# Altium schematic sheet powerPCB.SchDoc
size A; SheetNumber: 1; SheetTotal: 1
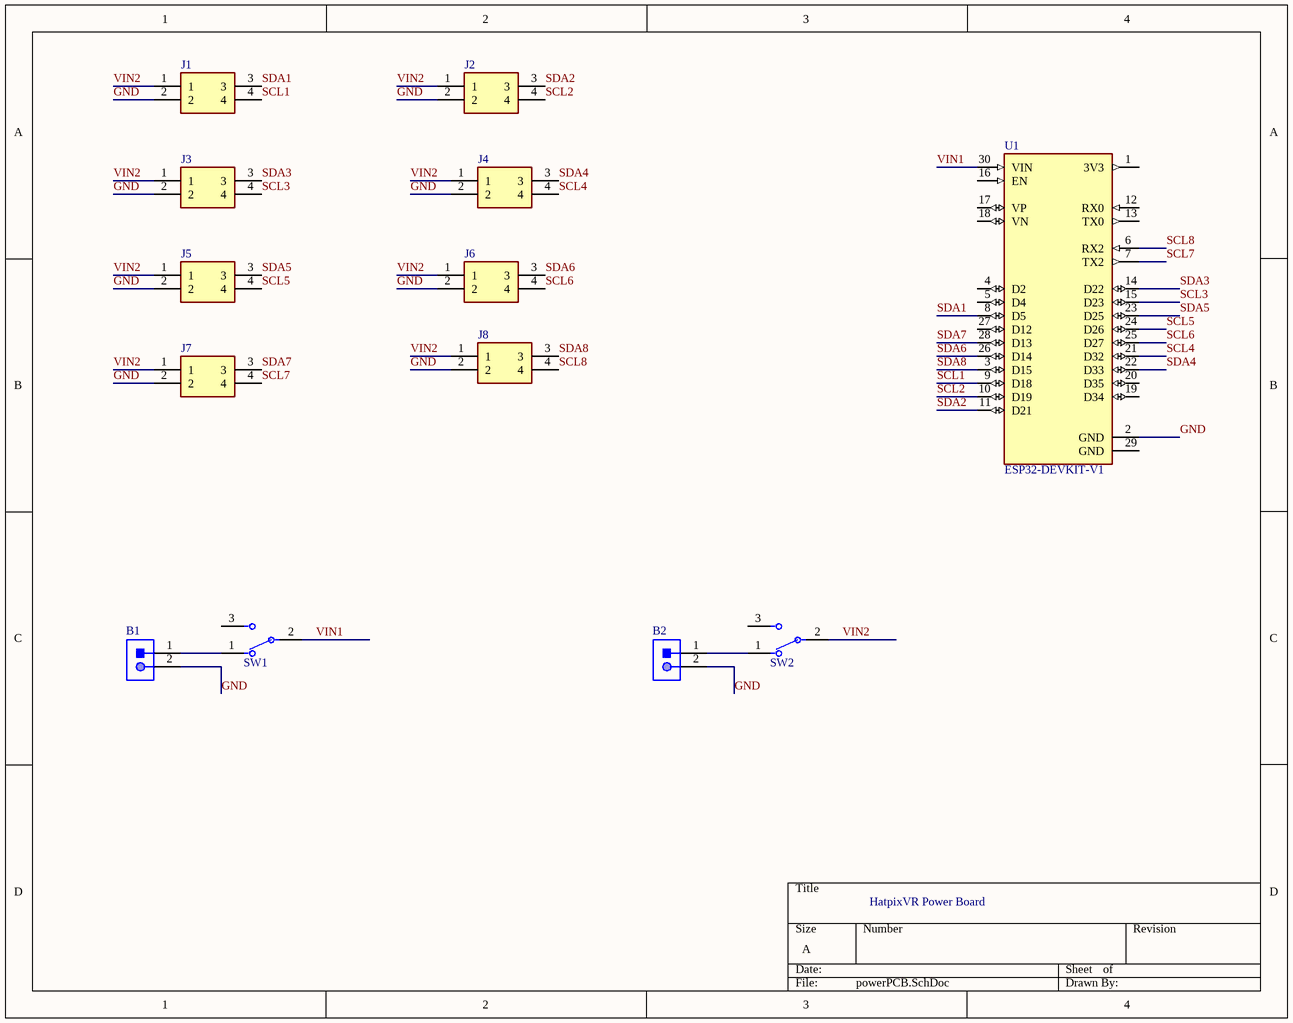
[diagram p0: powerPCB.SchDoc]

## Parts
B1  S2B-PH-K-S(LF)(SN)  [JST-S2B-PH-K-S_V]  (value not drawn)
B2  S2B-PH-K-S(LF)(SN)  [JST-S2B-PH-K-S_V]  (value not drawn)
J1  200528-0040  [200528-0040]  (value not drawn)
J2  200528-0040  [200528-0040]  (value not drawn)
J3  200528-0040  [200528-0040]  (value not drawn)
J4  200528-0040  [200528-0040]  (value not drawn)
J5  200528-0040  [200528-0040]  (value not drawn)
J6  200528-0040  [200528-0040]  (value not drawn)
J7  200528-0040  [200528-0040]  (value not drawn)
J8  200528-0040  [200528-0040]  (value not drawn)
SW1  1101M2S3CGE2  [FP-1101M2S3CGE2-MFG]  (value not drawn)
SW2  1101M2S3CGE2  [FP-1101M2S3CGE2-MFG]  (value not drawn)
U1  ESP32-DEVKIT-V1  [MODULE_ESP32_DEVKIT_V1]

## Nets
GND: B1.2 B2.2 J1.2 J2.2 J3.2 J4.2 J5.2 J6.2 J7.2 J8.2 U1.2(GND)
SCL1: J1.4 U1.9(D18)
SCL2: J2.4 U1.10(D19)
SCL3: J3.4 U1.15(D23)
SCL4: J4.4 U1.21(D32)
SCL5: J5.4 U1.24(D26)
SCL6: J6.4 U1.25(D27)
SCL7: J7.4 U1.7(TX2)
SCL8: J8.4 U1.6(RX2)
SDA1: J1.3 U1.8(D5)
SDA2: J2.3 U1.11(D21)
SDA3: J3.3 U1.14(D22)
SDA4: J4.3 U1.22(D33)
SDA5: J5.3 U1.23(D25)
SDA6: J6.3 U1.26(D14)
SDA7: J7.3 U1.28(D13)
SDA8: J8.3 U1.3(D15)
VIN1: SW1.2(COMM) U1.30(VIN)
VIN2: J1.1 J2.1 J3.1 J4.1 J5.1 J6.1 J7.1 J8.1 SW2.2(COMM)
NetB1_1: B1.1 SW1.1
NetB2_1: B2.1 SW2.1

Not connected (* = marked no-connect by the designer): SW1 3; SW2 3; U1 1(3V3) 4(D2) 5(D4) 12(RX0) 13(TX0) 16(EN) 17(VP) 18(VN) 19(D34) 20(D35) 27(D12) 29(GND)

## Notes on the sheet
- HatpixVR Power Board

## Library data of the parts
B1 B2 = CMP-1755-00004-1: Male Header, Pitch 2 mm, 1 x 2 Position, Height 4.8 mm, Tail Length 3.4 mm, -25 to 85 degC, RoHS, Bulk; Case\Package: Radial; Tolerance: 20%; Capacitance: 10 uF; Voltage Rating (DC): 50 V; Packaging: Bulk; ComponentLink1URL: http://www.jst-mfg.com/product/pdf/eng/ePH.pdf; Radiation Hardening: No; Height: 11 mm; Package Quantity: 200; PackageDescription: Male Header, Pitch 2 mm, 1 x 2 Position, Height 4.8 mm, Tail Length 3.4 mm; PackageReference: S2B-PH-K-S; Diameter: 5 mm; Pins: 2; Mount: Through Hole; Max Operating Temperature: 85 degC; Min Operating Temperature: -40 degC; ComponentLink1Description: Datasheet; DatasheetVersion: Dec-12; Length: 11 mm; Lead Pitch: 2 mm; REACH SVHC: No SVHC; Voltage Rating: 50 V; RoHSCompliant: true
J1-J8 = 200528-0040: Connector; Manufacturer_Name: Molex; Description: 1.0mm R/A FFC/FPC connector; Datasheet Link: http://www.molex.com/webdocs/datasheets/pdf/en-us//2005280040_FFC_FPC_CONNECTORS.pdf; Manufacturer_Part_Number: 200528-0040; Mouser Part Number: 538-200528-0040; Mouser Price/Stock: https://www.mouser.co.uk/ProductDetail/Molex/200528-0040?qs=IvjI65BR3TWJ39ZrkPFPSw%3D%3D
SW1 SW2 = CMP-10038-000004-1: SWITCH SLIDE SPDT 6A 120V; Manufacturer: C&K Components; Contact Resistance: 10mΩ; Voltage Rating Dc: 28V; Electromechanical Life: 40000Cycles; Octopart: https://octopart.com/1101m2s3cge2-c%26k+components-2817222; Temperature Range Low: -30°C; Automotive: No; Device Class L2: Switches; RoHS: TRUE; Device Class L3: Slide Switches; Throw Configuration: SPDT; Temperature Range High: +65°C; Mouser Description: Switch Slide ON None ON SPDT Top Slide 6A 250VAC 28VDC 0.4VA PC Pins Thru-Hole Bulk; Contact Current Rating: 6A; Temperature: -30°C to +65°C; Manufacturer Part Number: 1101M2S3CGE2; ComponentLink2Description: Datasheet; Lead Free: Yes; Package: 1101M2S3CGE2; Height: 13.34mm; Voltage Rating Ac: 120V; Digikey Description: SWITCH SLIDE SPDT 6A 120V; ComponentLink2URL: https://www.ckswitches.com/media/1429/1000.pdf; Device Class L1: Electromechanical; Category: Switch; Mount: Through Hole
U1 = ESP32-DEVKIT-V1: Dual core, Wi-Fi: 2.4 GHz up to 150 Mbits/s,BLE (Bluetooth Low Energy) and legacy Bluetooth, 32 bits, Up to 240 MHz; MF: Do it; Price: None; Availability: Not in stock; Package: None; MP: ESP32-DEVKIT-V1; Value: *; SnapEDA_Link: https://www.snapeda.com/parts/ESP32-DEVKIT-V1/Do+it/view-part/?ref=snap; Check_prices: https://www.snapeda.com/parts/ESP32-DEVKIT-V1/Do+it/view-part/?ref=eda